# EAGLE design back (EAGLE 9.0.1)
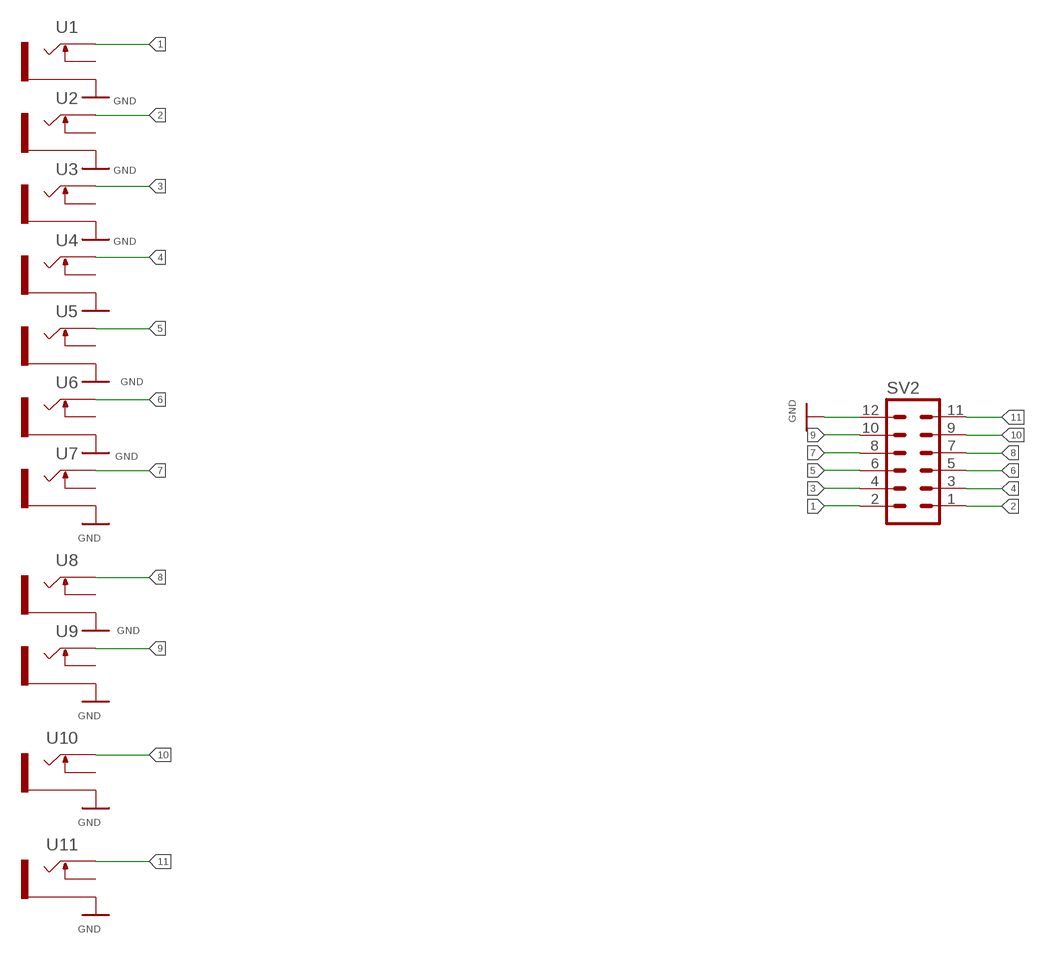
[diagram p0: schematic, sheet 1]

## Parts
SV2  MA06-2  [MA06-2]
U1  THONKICONNNEW  [WQP-PJ301M-12_JACK]
U2  THONKICONN16PJ138  [WQP-PJ301M-12_JACK]
U3  THONKICONNNEW  [WQP-PJ301M-12_JACK]
U4  THONKICONNNEW  [WQP-PJ301M-12_JACK]
U5  THONKICONNNEW  [WQP-PJ301M-12_JACK]
U6  THONKICONNNEW  [WQP-PJ301M-12_JACK]
U7  THONKICONNNEW  [WQP-PJ301M-12_JACK]
U8  THONKICONNNEW  [WQP-PJ301M-12_JACK]
U9  THONKICONNNEW  [WQP-PJ301M-12_JACK]
U10  THONKICONNNEW  [WQP-PJ301M-12_JACK]
U11  THONKICONNNEW  [WQP-PJ301M-12_JACK]

## Nets
1: SV2.2 U1.P$1_TIP(TIP)
2: SV2.1 U2.P$1_TIP(TIP)
3: SV2.4 U3.P$1_TIP(TIP)
4: SV2.3 U4.P$1_TIP(TIP)
5: SV2.6 U5.P$1_TIP(TIP)
6: SV2.5 U6.P$1_TIP(TIP)
7: SV2.8 U7.P$1_TIP(TIP)
8: SV2.7 U8.P$1_TIP(TIP)
9: SV2.10 U9.P$1_TIP(TIP)
10: SV2.9 U10.P$1_TIP(TIP)
11: SV2.11 U11.P$1_TIP(TIP)
GND: SV2.12 U1.P$3_SLEEVE(SLEEVE) U2.P$3_SLEEVE(SLEEVE) U3.P$3_SLEEVE(SLEEVE) U4.P$3_SLEEVE(SLEEVE) U5.P$3_SLEEVE(SLEEVE) U6.P$3_SLEEVE(SLEEVE) U7.P$3_SLEEVE(SLEEVE) U8.P$3_SLEEVE(SLEEVE) U9.P$3_SLEEVE(SLEEVE) U10.P$3_SLEEVE(SLEEVE) U11.P$3_SLEEVE(SLEEVE)
Unconnected: U1.P$2_SWITCH(SWITCH) U2.P$2_SWITCH(SWITCH) U3.P$2_SWITCH(SWITCH) U4.P$2_SWITCH(SWITCH) U5.P$2_SWITCH(SWITCH) U6.P$2_SWITCH(SWITCH) U7.P$2_SWITCH(SWITCH) U8.P$2_SWITCH(SWITCH) U9.P$2_SWITCH(SWITCH) U10.P$2_SWITCH(SWITCH) U11.P$2_SWITCH(SWITCH)

## Library data of the parts
SV2 = con-lstb:MA06-2: PIN HEADER; OC_FARNELL: unknown; OC_NEWARK: unknown
U1-U11 = MusicThingModular:THONKICONN: 3.5mm socket for Eurorack modular synths

## Board
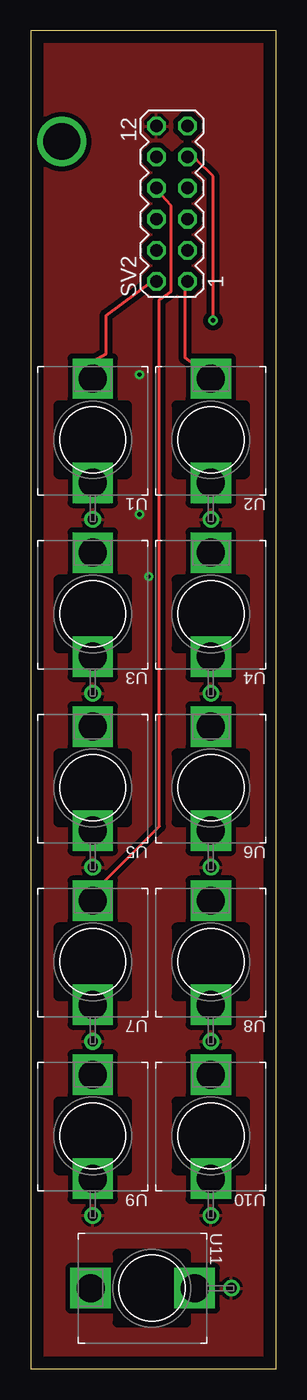
[diagram p1: board, top side]
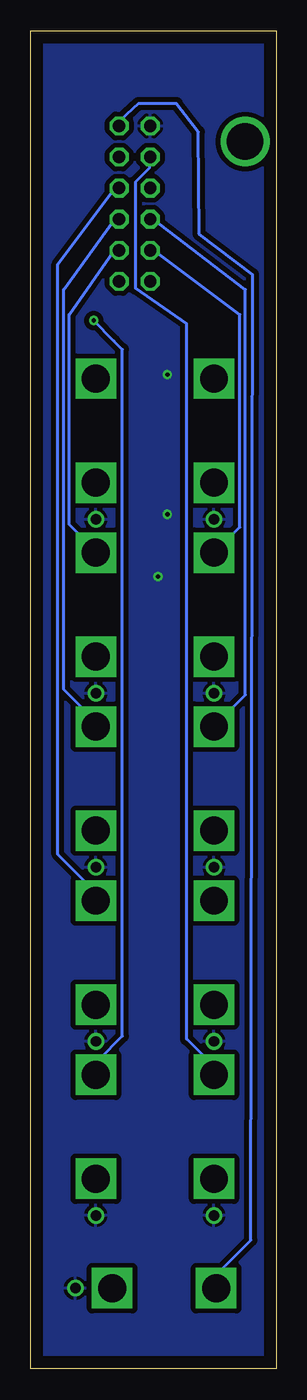
[diagram p2: board, bottom side, seen from below]

Size 20.07 x 109.4 mm. Coordinates in mm from the lower left corner, seen from the top.
Outline: 0,109.4 0,0 20.07,0 20.07,109.4 0,109.4
Copper layers (1*16): Top 0.035mm / dielectric 1.5mm / Bottom 0.035mm
Design rules "default *": minimum track width 10mil, minimum drill 0.35mm, track to track 8mil, track to pad 8mil, pad to pad 6mil, via to via 6mil, smd to smd 6mil, copper to edge 40mil, drill to drill 6mil, minimum pad ring 10mil, minimum via ring 8mil, stop-mask expansion 4mil, vias tented up to drill 0mil, thermal gap 10mil

### Footprints (pad centres in the part's own frame; a part is rotated, then mirrored left to right if it is on the bottom)
MA06-2 = drill 1.016 octagon: 1 -6.35,-1.27; 2 -6.35,1.27; 3 -3.81,-1.27; 4 -3.81,1.27; 5 -1.27,-1.27; 6 -1.27,1.27; 7 1.27,-1.27; 8 1.27,1.27; 9 3.81,-1.27; 10 3.81,1.27; 11 6.35,-1.27; 12 6.35,1.27
WQP-PJ301M-12_JACK = drill 2.286 pad 2.413 square: P$1_TIP 0,5; P$2_SWITCH 0,-3.5 | drill 0.85: P$3_SLEEVE 0,-6.5

### Placement (x,y rotation side)
SV2  11.56,95.25 90 top
U1  5.08,75.95 0 top
U2  14.73,75.95 0 top
U3  5.08,61.72 0 top
U4  14.73,61.72 0 top
U5  5.08,47.5 0 top
U6  14.73,47.5 0 top
U7  5.08,33.27 0 top
U8  14.73,33.27 0 top
U9  5.08,19.05 0 top
U10  14.73,19.05 0 top
U11  9.91,6.6 90 top

### Tracks (layer width: path | path; a pad name or v marks a point on that pad's centre or on a via)
1
  Top 0.254: U1.P$1_TIP 5,81.38 5,82.32 6.17,82.98 6.17,86.11 9.98,88.9 SV2.2
2
  Top 0.254: SV2.1 12.85,88.8 12.62,88.57 12.62,82.65 14.63,81.15 U2.P$1_TIP
3
  Bottom 0.254: U3.P$1_TIP 5.03,67.44 4.34,67.44 2.97,68.81 2.97,86.18 10.01,91.44 SV2.4
4
  Bottom 0.254: SV2.3 12.85,91.31 13.31,91.31 16.92,86.18 16.92,69.04 15.32,67.44 14.86,67.44 U4.P$1_TIP
5
  Bottom 0.254: U5.P$1_TIP 5.03,53.26 4.57,53.26 4.12,53.72 3.89,53.72 2.52,55.09 2.52,88.24 10.03,93.98 SV2.6
6
  Bottom 0.254: SV2.5 12.85,93.83 13.31,93.83 17.37,88.24 17.37,55.55 14.86,53.03 U6.P$1_TIP
7
  Top 0.254: SV2.8 10.34,96.34 11.48,95.07 11.48,88.06 10.52,87.38 10.52,44.35 5.26,39.09 U7.P$1_TIP
8
  Bottom 0.254: SV2.7 12.85,96.34 13.31,96.34 17.83,90.3 17.83,42.06 14.86,39.09 U8.P$1_TIP
9
  Bottom 0.254: SV2.10 10.34,98.86 10.34,98.17 11.48,97.03 11.48,88.34 7.32,85.45 7.32,26.98 5.71,25.38 5.26,25.38 U9.P$1_TIP
10  (via drill 0.35)
  Top 0.254: v14.91,85.7 14.91,97.48 13.54,98.86 12.85,98.86 SV2.9
  Bottom 0.254: v14.91,85.7 13.26,84.02 12.57,83.34 12.57,27.2 14.46,25.32 U10.P$1_TIP
11
  Bottom 0.254: SV2.11 12.75,101.6 12.75,102.06 11.25,103.43 8.15,103.43 6.35,101.09 6.3,92.76 1.93,89.46 2.06,10.52 4.8,7.77 4.8,7.32 U11.P$1_TIP
GND  (via drill 0.35)
  other vias: 8.89,81.28 8.89,69.85 9.65,64.77
  pour Bottom (isolate 0.406): 0,113.03 20.32,113.03 20.32,0 0,0
  pour Top (isolate 0.406): 20.32,111.76 0,111.76 0,0 20.32,0
N$1  (via drill 3)
  other vias: 2.54,100.33